# EAGLE design duende2 (EAGLE 7.3.0)
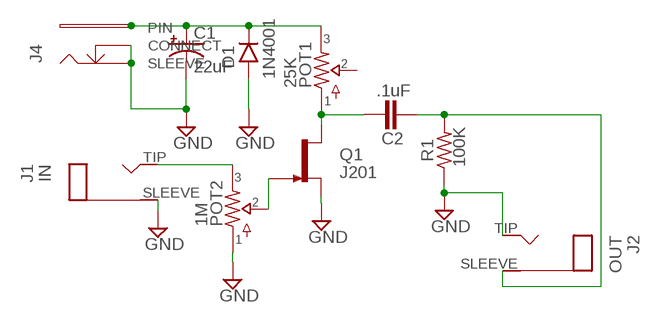
[diagram p0: schematic, sheet 1]

## Parts
C1  22uF  0501  [050_020_1]
C2  .1uF  CER/FILM1  [050X030_025]
D1  1N4001  DO35.1  [DO41-1]
J1  IN  MONOPADS  [TWO_PADS]
J2  OUT  MONOPADS  [TWO_PADS]
J4  DC +9V  DC  [DC_POWER_JACK]
POT1  25K  POTSTRIM  [2262_TRIM]
POT2  1M  POTSSMALL_PADS  [PADS_SMALL]
Q1  J201  [TO92-]
R1  100K  R_.3B  [R0207/3]

## Nets
+9V: C1.- D1.A J1.SLEEVE J2.TIP J4.CLOSE(CONNECT) J4.SLEEVE POT2.1 Q1.2(S) R1.1 ; supply symbol labelled GND
GND: C2.2 J2.SLEEVE R1.2
N$1: C2.1 POT1.1 Q1.3(D)
N$3: POT2.2 Q1.1(G)
N$4: J1.TIP POT2.3
N$5: C1.+ D1.C POT1.3
Unconnected: J4.PIN POT1.2

## Library data of the parts
C1 = capacitors-elec:050: 0.22 - 100uF Xicon values at Mouser.com: 10V: 10 - 100uF; 16V: 2.2 - 47uF; 25V: 0.47 - 47uF; 50V: 0.22 - 22uF
C2 = capacitors-film:CER/FILM: 47 - 120pF Xicon Ceramic Disc 2.5mm lead spacing
D1 = diodes:DO35: DO-35 Package Diodes: 1N914
J1 J2 = jacks:MONO: Mono 1/4" Phone Jack
J4 = jacks:DC: DC Jack
POT1 POT2 = potentiometers:POTS
Q1 = transistors:J201: N-channel JFET
R1 = resistors:R_

## Net classes
0 default: clearance 0.205 mm

## Board
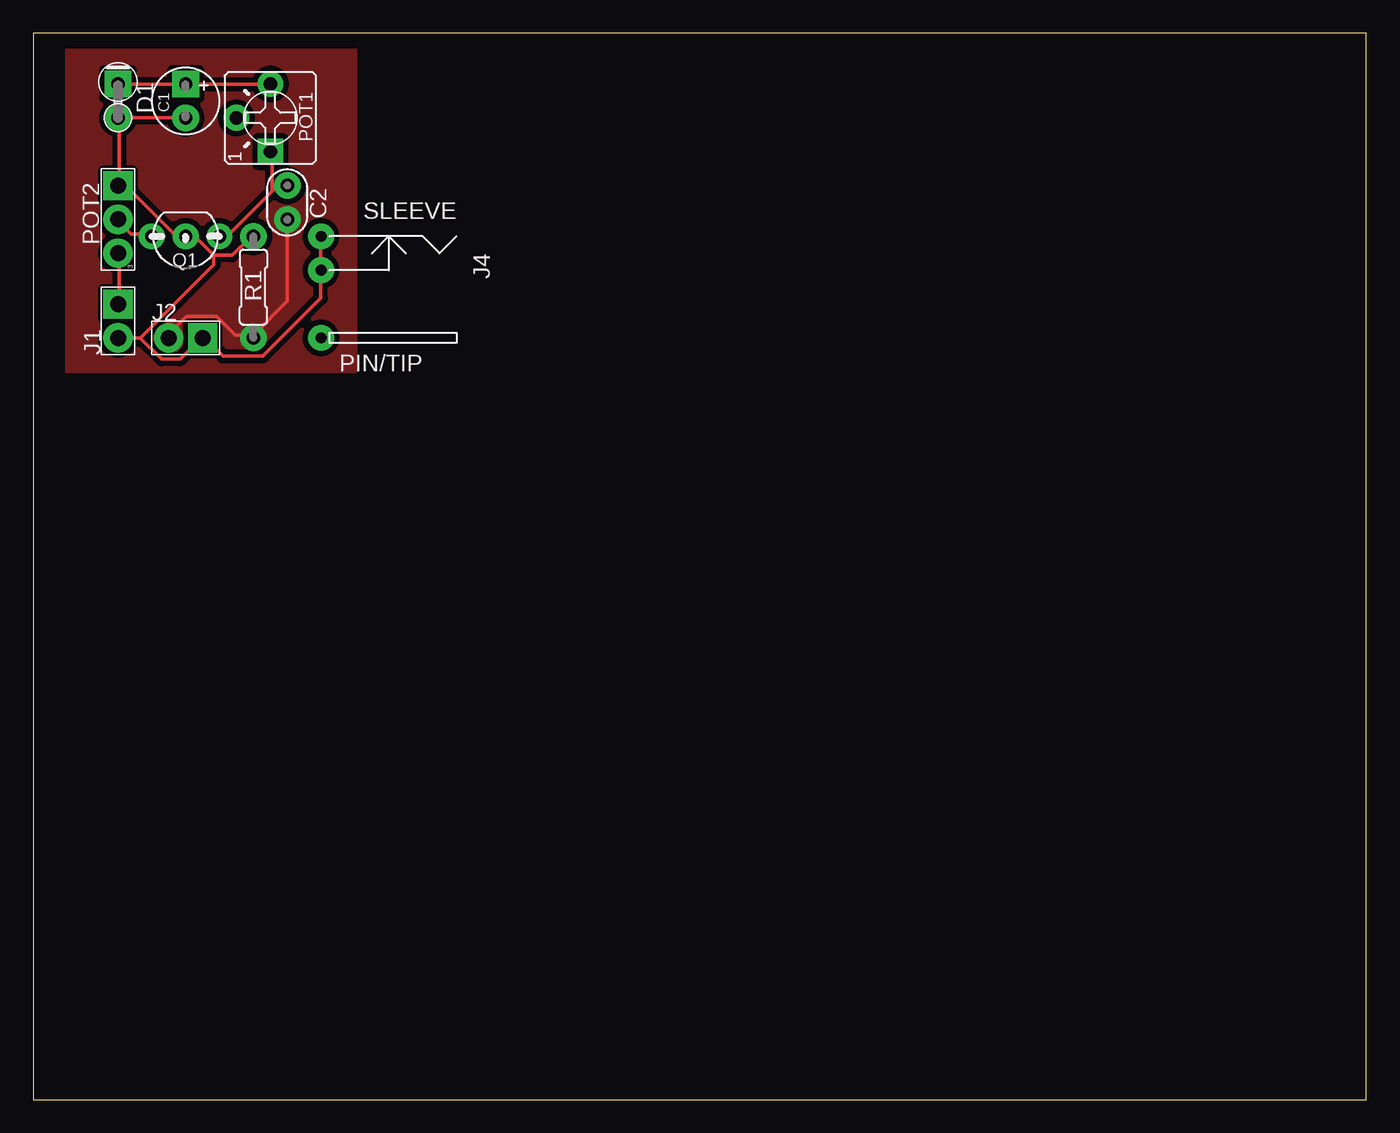
[diagram p1: board, top side]

Size 100 x 80 mm. Coordinates in mm from the lower left corner, seen from the top.
Outline: 0,0 100,0 100,80 0,80 0,0
Copper layers (1*16): Top 0.035mm / dielectric 1.5mm / Bottom 0.035mm
Design rules "default": minimum track width 10mil, minimum drill 24mil, track to track 8mil, track to pad 8mil, pad to pad 8mil, via to via 8mil, smd to smd 8mil, copper to edge 40mil, drill to drill 8mil, minimum pad ring 10mil, minimum via ring 8mil, stop-mask expansion 4mil, vias tented up to drill 0mil, thermal gap 10mil

### Footprints (pad centres in the part's own frame; a part is rotated, then mirrored left to right if it is on the bottom)
050_020_1 = drill 1 pad 2 square: + -1.27,0 | drill 1 pad 2: - 1.27,0
050X030_025 = drill 1 pad 2: 1 -1.27,0; 2 1.27,0
DO41-1 = drill 1 pad 2: A 1.27,0 | drill 1 pad 2 square: C -1.27,0
TWO_PADS = drill 1.2 pad 2.184: SLEEVE -1.27,0 | drill 1.2 pad 2.184 square: TIP 1.27,0
DC_POWER_JACK = drill 0.8 pad 1.93: CLOSE 7.62,-2.54; PIN 7.62,2.54; SLEEVE 7.62,-5.08
2262_TRIM = drill 1 pad 1.93 square: 1 -2.54,0 | drill 1 pad 1.93: 2 0,2.54; 3 2.54,0
PADS_SMALL = drill 1.2 pad 2.184 square: 1 2.54,0 | drill 1.2 pad 2.184: 2 0,0; 3 -2.54,0
TO92- = drill 1 pad 1.93: 1 2.54,0; 2 0,0; 3 -2.54,0
R0207/3 = drill 1 pad 2: 1 -3.81,0; 2 3.81,0

### Placement (x,y rotation side)
C1  11.43,74.93 270 top
C2  19.05,67.31 270 top
D1  6.35,74.93 270 top
DRILEGEND  [DRILEGEND]  0,-3.81 0 top  (outside the outline)
J1  6.35,58.42 90 top
J2  11.43,57.15 0 top
J4  29.21,59.69 180 top
POT1  17.78,73.66 90 top
POT2  6.35,66.04 90 top
Q1  11.43,64.77 180 top
R1  16.51,60.96 270 top

### Tracks (layer width: path | path; a pad name or v marks a point on that pad's centre or on a via)
+9V
  Top 0.254: 13.54,63.34 12.16,64.72 11.47,64.72 Q1.2 11.24,64.95 10.56,64.95 7.11,68.39 6.43,68.39 POT2.1 6.43,68.62 6.43,73.44 D1.A 6.43,73.67 11.24,73.67 C1.- | 13.54,63.34 14.92,63.34 16.29,64.72 R1.1 | J4.SLEEVE 21.57,64.72 21.57,62.42 J4.CLOSE 21.57,62.19 21.57,60.13 17.21,55.77 14.23,55.77 12.85,57.15 J2.TIP 12.62,57.15 11.02,55.54 9.64,55.54 8.03,57.15 | 8.03,57.15 6.43,57.15 J1.SLEEVE | 13.54,63.34 13.54,62.65 8.03,57.15
GND
  Top 0.254: J2.SLEEVE 10.1,57.38 11.47,58.75 13.77,58.75 15.15,57.38 16.29,57.38 R1.2 16.52,57.38 19.05,59.9 19.05,65.87 C2.2
  pour Top (isolate 0.406, no thermals): 2.54,78.74 24.13,78.74 24.13,54.61 2.54,54.61
N$1
  Top 0.254: 17.9,68.16 18.13,68.39 19.05,68.39 C2.1 | 17.9,68.16 14.69,64.95 14,64.95 Q1.3 | 17.9,68.16 17.9,70.92 POT1.1
N$3
  Top 0.254: Q1.1 8.72,64.95 7.34,64.95 6.43,65.87 POT2.2
N$4
  Top 0.254: J1.TIP 6.43,59.9 6.43,63.34 POT2.3
N$5
  Top 0.254: POT1.3 17.67,76.19 11.47,76.19 C1.+ 11.24,76.19 6.43,76.19 D1.C

### Text on the board
DrillLegend: LAYER-STACK
DrillLegend_01-16: 01-16